# EasyEDA Pro project 消毒盒_灯带——编码器.epro

# Schematic 消毒盒3.0
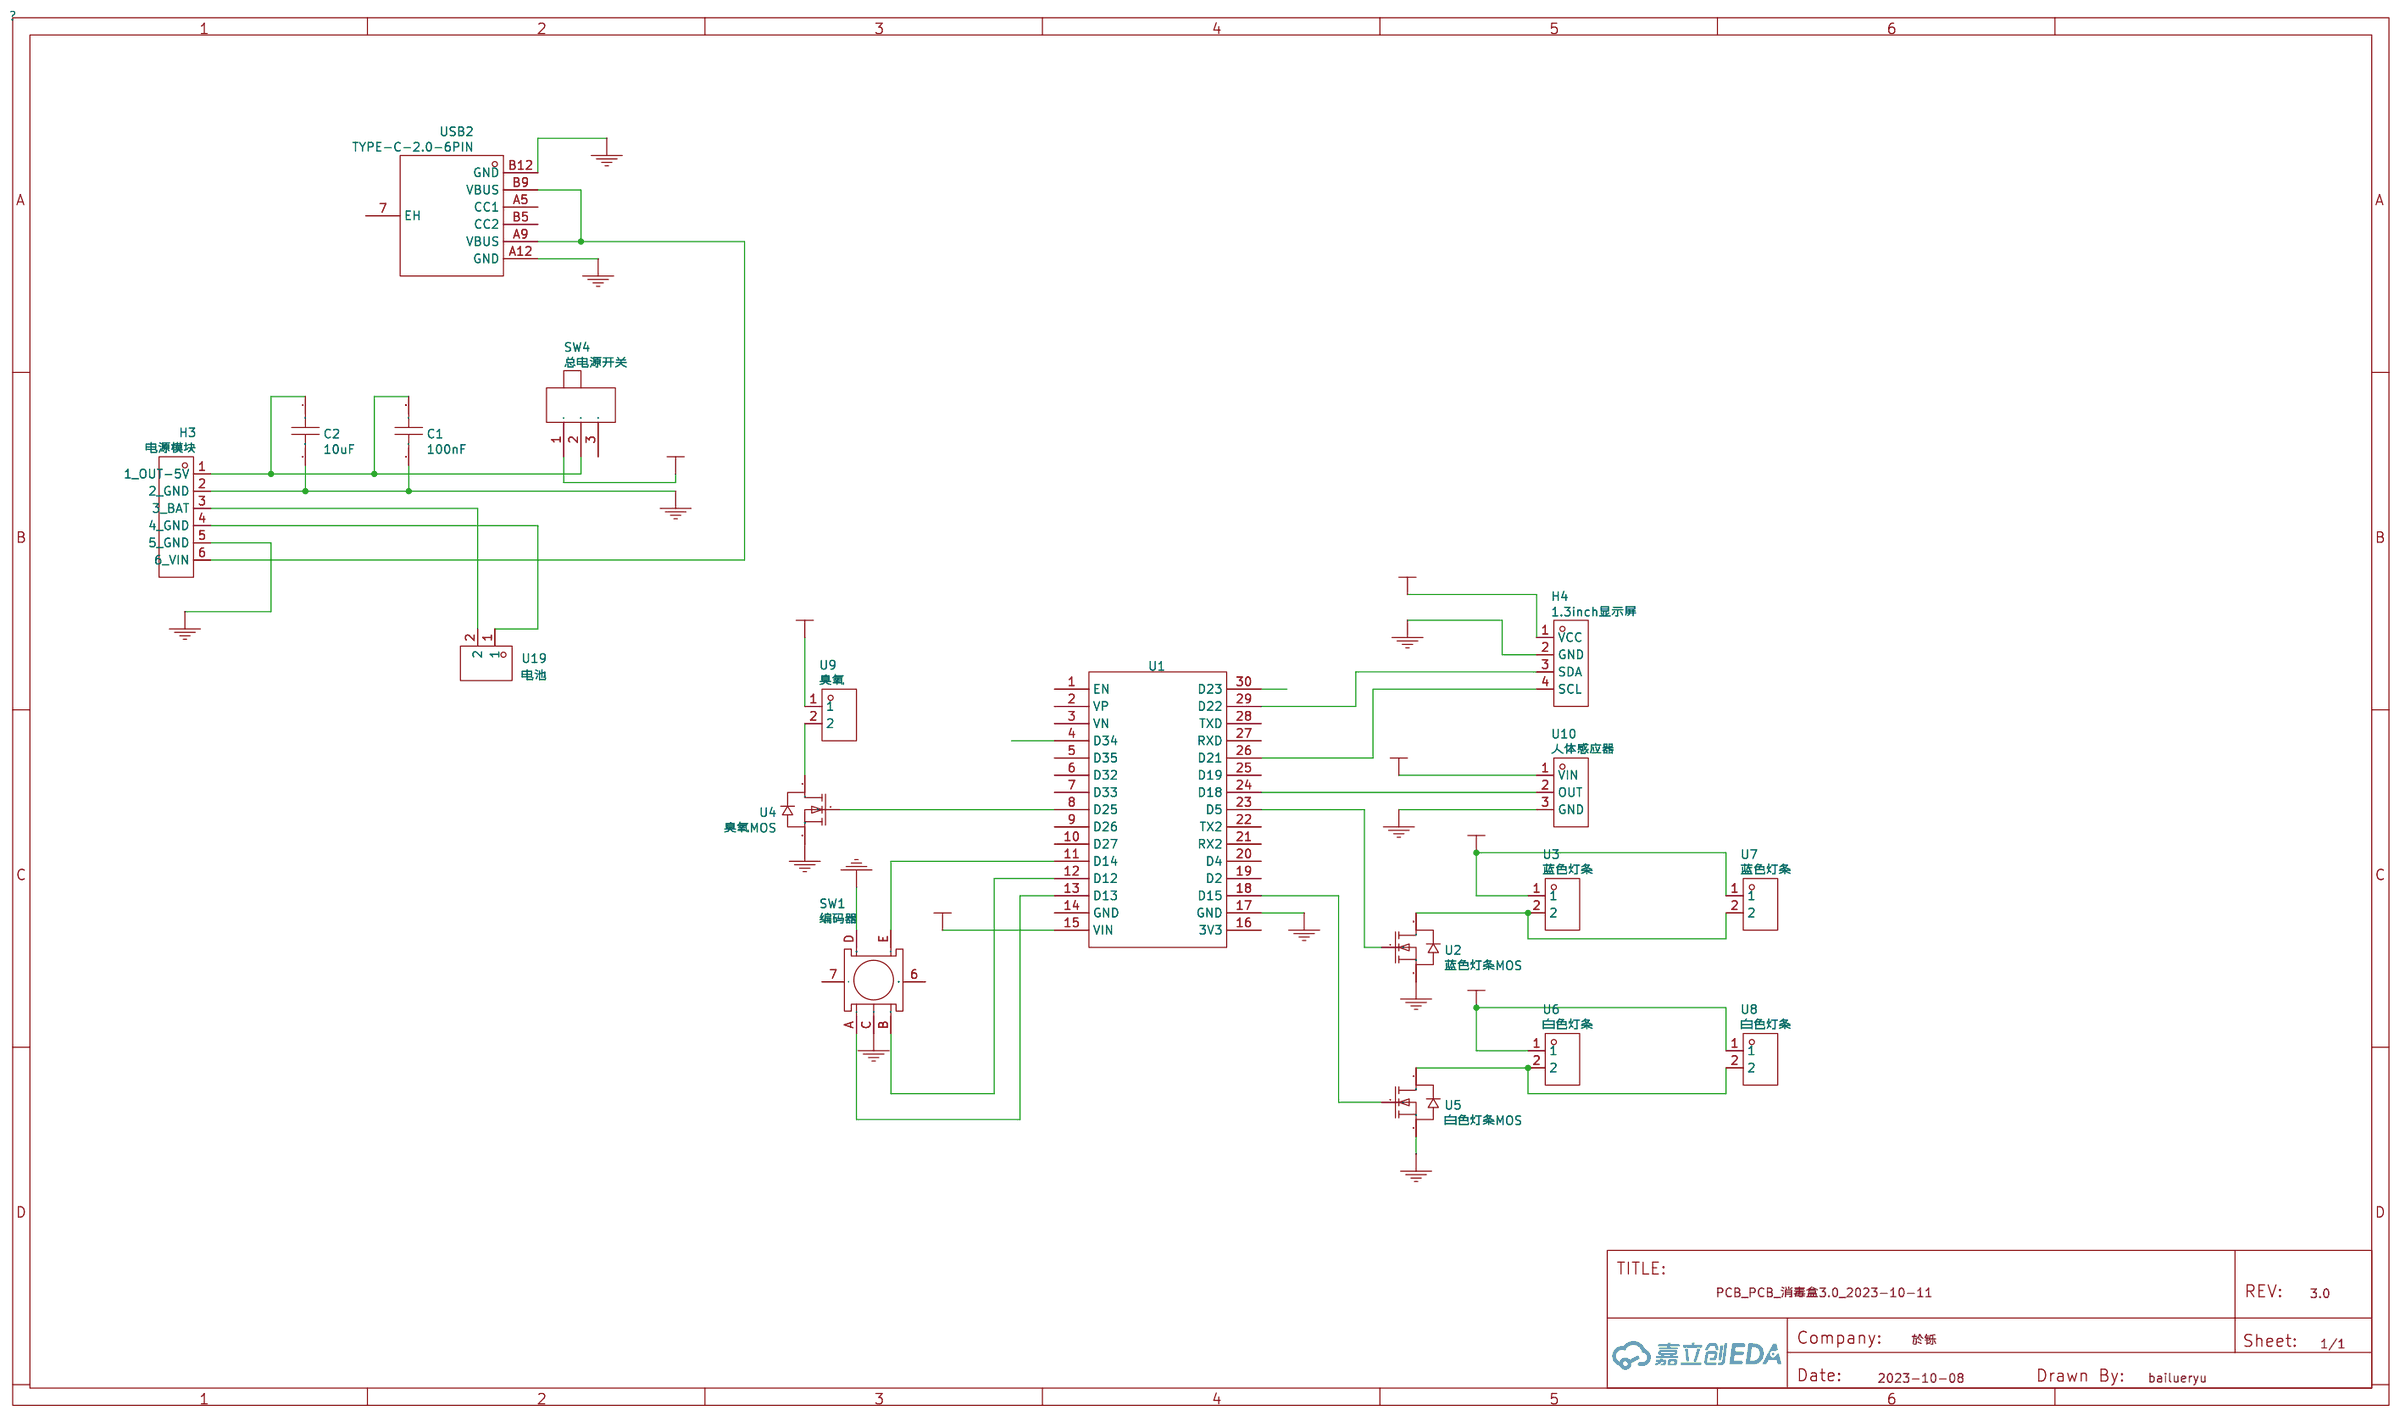
[diagram p0: schematic sheet]

## Parts
C1  100nF  [C0603]
C2  10uF  [C0603]
H3  电源模块  [HDR-TH_6P-P2.54-V-M]
H4  1.3inch显示屏  [HDR-TH_4P-P2.54-V-M]
SW1  编码器  [SW-TH_EC11E18244A5]
SW4  总电源开关  [SW-TH_MK-12D18-G040]
U1  NO  [ESP-WROOM-32]
U2  蓝色灯条MOS  [SOT-23-3_L2.9-W1.3-P1.90-LS2.4-BR]
U3  蓝色灯条  [HDR-TH_2P-P2.00-V-M]
U4  臭氧MOS  [SOT-23-3_L2.9-W1.3-P1.90-LS2.4-BR]
U5  白色灯条MOS  [SOT-23-3_L2.9-W1.3-P1.90-LS2.4-BR]
U6  白色灯条  [HDR-TH_2P-P2.00-V-M]
U7  蓝色灯条  [HDR-TH_2P-P2.00-V-M]
U8  白色灯条  [HDR-TH_2P-P2.00-V-M]
U9  臭氧  [HDR-TH_2P-P2.00-V-M]
U10  人体感应器  [HDR-TH_3P-P2.00-V-M]
U19  电池  [HDR-TH_2P-P2.00-V-M]
USB2  TYPE-C-2.0-6PIN  [TYPE-C-SMD_TYPE-C-6P-2]

## Library data of the parts
C1 = 100nF: link: https://so.szlcsc.com/global.html?k=C3152610&amp;ref=editor; 3DModel: C0603_L1.6-W0.8-H0.8; Supplier: LCSC; Supplier Part: C3152610; Manufacturer: Sunway(信维通信); Manufacturer Part: MC0603B104K500N8RH; JLCPCB Part Class: Extended Part
C2 = 10uF: link: https://so.szlcsc.com/global.html?k=C15415&amp;ref=editor; 3DModel: C0603_L1.6-W0.8-H0.8; Supplier: LCSC; Supplier Part: C15415; Manufacturer: SAMSUNG(三星); JLCPCB Part Class: Extended Part
H3 = 电源模块: link: https://so.szlcsc.com/global.html?k=C492405&amp;ref=editor; 3DModel: HDR-TH_6P-P2.54-M-LI-1X6P; Supplier: LCSC; Supplier Part: C492405; Manufacturer: XFCN(兴飞); Manufacturer Part: PZ254V-11-06P; JLCPCB Part Class: Extended Part
H4 = 1.3inch显示屏: link: https://so.szlcsc.com/global.html?k=C2905435&amp;ref=editor; 3DModel: HDR-TH_4P-P2.54-M-LI-1X4P; Supplier: LCSC; Supplier Part: C2905435; Manufacturer: kinghelm(金航标); Manufacturer Part: KH-2.54PH180-1X4P-L11.5; JLCPCB Part Class: Extended Part
SW1 = 编码器: link: https://so.szlcsc.com/global.html?k=C255515&amp;ref=editor; 3DModel: SW-TH_EC11E18244A5-L11.7-W12.0-H24.5-P2.5-LS14.5; Supplier: LCSC; Supplier Part: C255515; Manufacturer: ALPS Electric; Manufacturer Part: EC11E18244A5; JLCPCB Part Class: Extended Part
SW4 = 总电源开关: link: https://so.szlcsc.com/global.html?k=C3019727&amp;ref=editor; Supplier: LCSC; Supplier Part: C3019727; Manufacturer: G-Switch(品赞); Manufacturer Part: MK-12D18-G020; JLCPCB Part Class: Extended Part
U1 = NO
U2 = 蓝色灯条MOS: link: https://so.szlcsc.com/global.html?k=C5358569&amp;ref=editor; 3DModel: SOT-23-3P_L2.9-W1.3-H1.0-LS2.4-P0.95; Supplier: LCSC; Supplier Part: C5358569; Manufacturer: GOODWORK(固得沃克); Manufacturer Part: 5N10
U3 U7 = 蓝色灯条: link: https://so.szlcsc.com/global.html?k=C18164974&amp;ref=editor; 3DModel: HDR-TH_2P-P2.00-M-LI-1X2P; Supplier: LCSC; Supplier Part: C18164974; Manufacturer: CONNFLY; Manufacturer Part: DS1025-01-1x2P8BV1-B
U4 = 臭氧MOS: link: https://so.szlcsc.com/global.html?k=C5358569&amp;ref=editor; 3DModel: SOT-23-3P_L2.9-W1.3-H1.0-LS2.4-P0.95; Supplier: LCSC; Supplier Part: C5358569; Manufacturer: GOODWORK(固得沃克); Manufacturer Part: 5N10
U5 = 白色灯条MOS: link: https://so.szlcsc.com/global.html?k=C5358569&amp;ref=editor; 3DModel: SOT-23-3P_L2.9-W1.3-H1.0-LS2.4-P0.95; Supplier: LCSC; Supplier Part: C5358569; Manufacturer: GOODWORK(固得沃克); Manufacturer Part: 5N10
U6 U8 = 白色灯条: link: https://so.szlcsc.com/global.html?k=C18164974&amp;ref=editor; 3DModel: HDR-TH_2P-P2.00-M-LI-1X2P; Supplier: LCSC; Supplier Part: C18164974; Manufacturer: CONNFLY; Manufacturer Part: DS1025-01-1x2P8BV1-B
U9 U19 = 臭氧: link: https://so.szlcsc.com/global.html?k=C18164974&amp;ref=editor; 3DModel: HDR-TH_2P-P2.00-M-LI-1X2P; Supplier: LCSC; Supplier Part: C18164974; Manufacturer: CONNFLY; Manufacturer Part: DS1025-01-1x2P8BV1-B
U10 = 人体感应器: link: https://so.szlcsc.com/global.html?k=C18164975&amp;ref=editor; 3DModel: HDR-TH_3P-P2.00-M-LI-1X3P; Supplier: LCSC; Supplier Part: C18164975; Manufacturer: CONNFLY; Manufacturer Part: DS1025-01-1x3P8BV1-B
USB2 = TYPE-C-2.0-6PIN: link: https://so.szlcsc.com/global.html?k=C2987385&amp;ref=editor; Supplier: LCSC; Supplier Part: C2987385; Manufacturer: CIKI(皓富); Manufacturer Part: Type-C-2.0-6Pin; JLCPCB Part Class: Extended Part

## Nets
GND: C1.1 C2.2 H3.2(2 GND) H3.5(5 GND) H4.2(GND) SW1.C SW1.D U1.17(GND) U2.2(S) U4.2(S) U5.2(S) U10.3(GND) USB2.A12(GND) USB2.B12(GND)
VCC: H4.1(VCC) SW4.1 U1.15(VIN) U3.1 U6.1 U7.1 U8.1 U9.1 U10.1(VIN)
$1N74: U1.23(D5) U2.1(G)
$1N112: U1.8(D25) U4.1(G)
$1N132: U1.18(D15) U5.1(G)
$1N227: SW1.A U1.13(D13)
$1N228: SW1.B U1.12(D12)
$1N380: SW1.E U1.11(D14)
Net-(C1-2): C1.2 C2.1 H3.1(1 OUT-5V) SW4.2
Net-(H3-3): H3.3(3 BAT) U19.2
Net-(H3-4): H3.4(4 GND) U19.1
Net-(H3-6): H3.6(6 VIN) USB2.A9(VBUS) USB2.B9(VBUS)
Net-(H4-3): H4.3(SDA) U1.29(D22)
Net-(H4-4): H4.4(SCL) U1.26(D21)
Net-(U1-24): U1.24(D18) U10.2(OUT)
Net-(U2-3): U2.3(D) U3.2 U7.2
Net-(U4-3): U4.3(D) U9.2
Net-(U5-3): U5.3(D) U6.2 U8.2

Not connected (* = marked no-connect by the designer): SW1 6 7; SW4 3; U1 1(EN) 2(VP) 3(VN) 4(D34) 5(D35) 6(D32) 7(D33) 9(D26) 10(D27) 14(GND) 16(3V3) 19(D2) 20(D4) 21(RX2) 22(TX2) 25(D19) 27(RXD) 28(TXD) 30(D23); USB2 7(EH) A5(CC1) B5(CC2)

# Board PCB_PCB_消毒盒3.0_2023-10-11
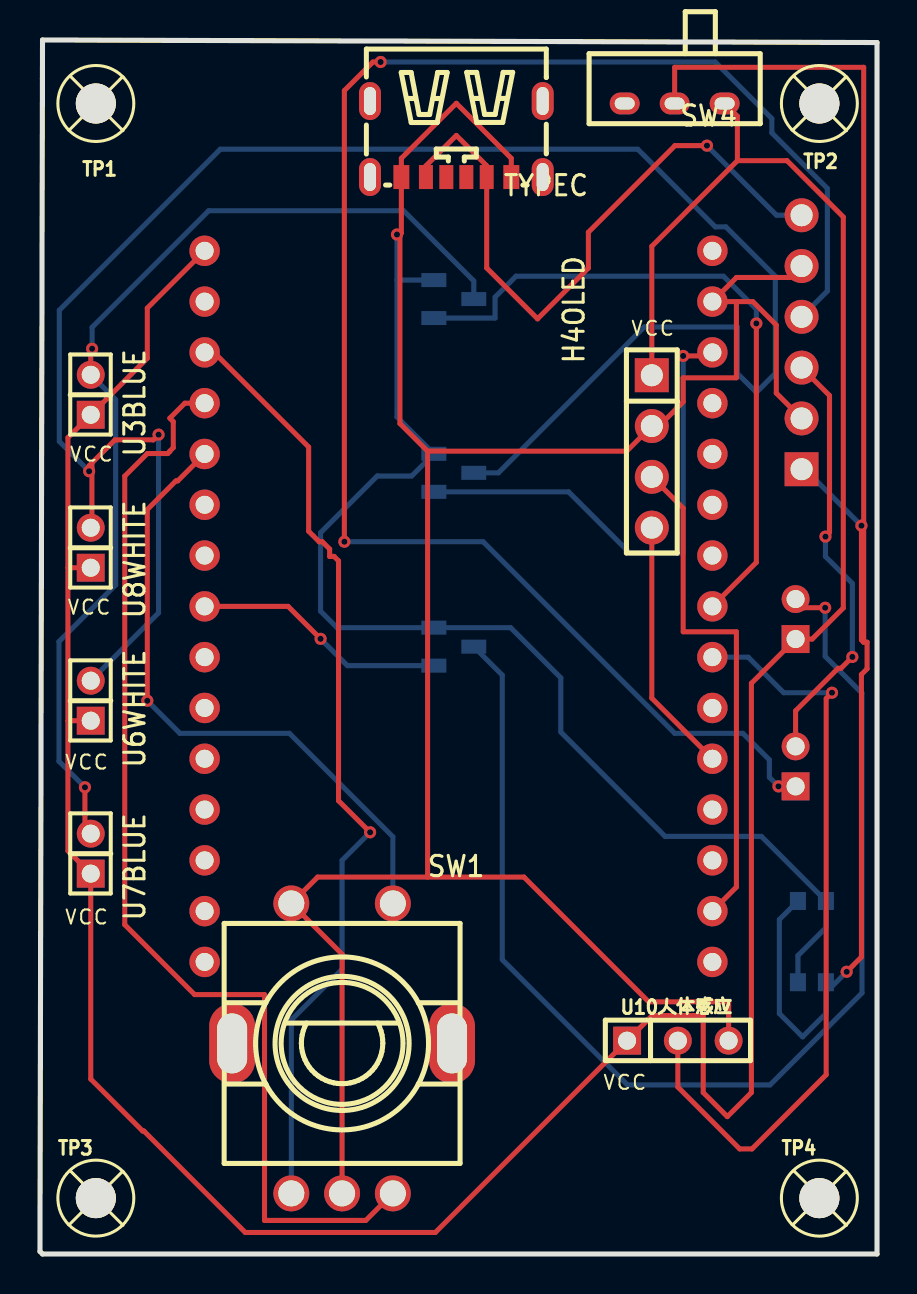
[diagram p1: board, top side]
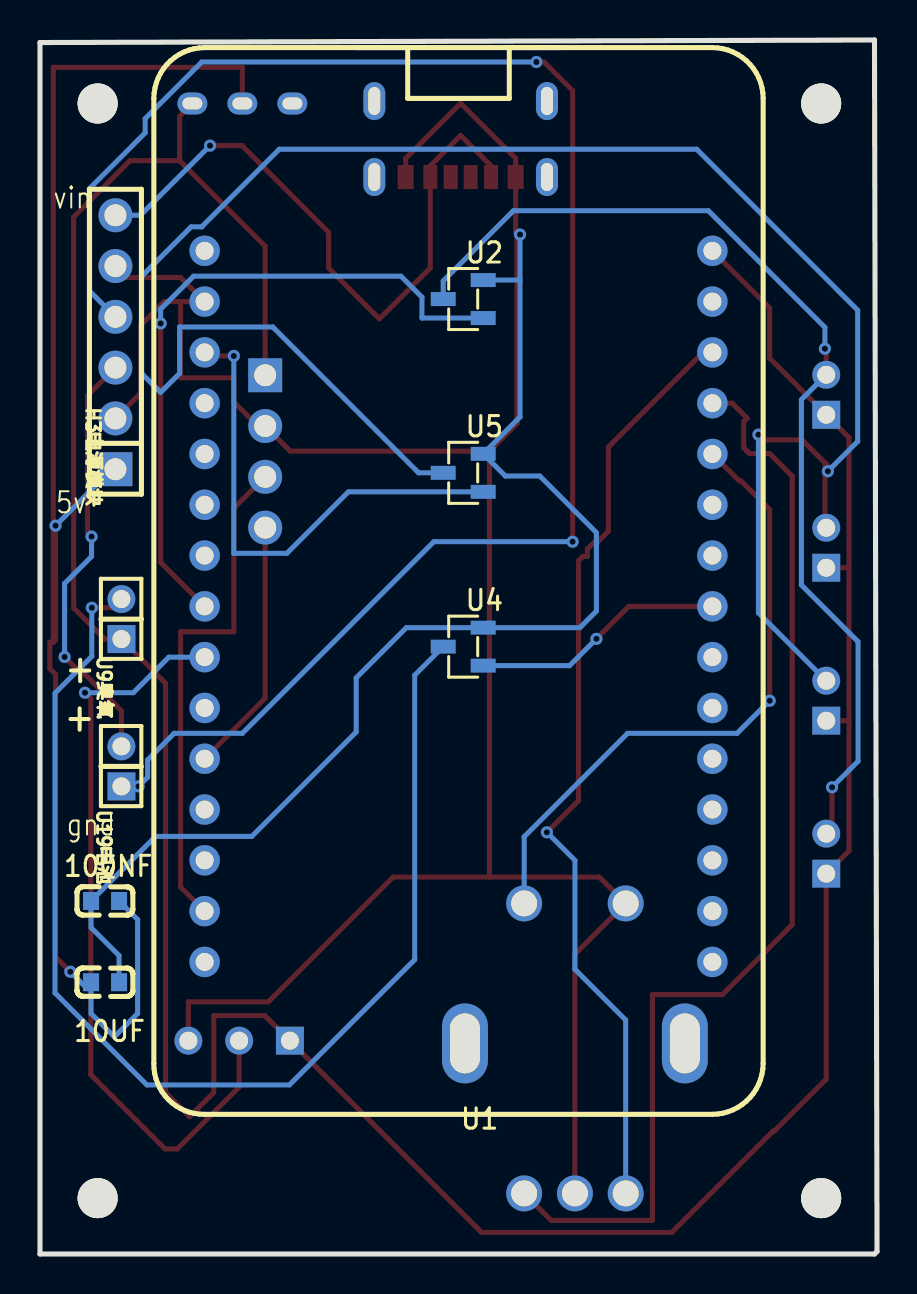
[diagram p2: board, bottom side, seen from below]

Outline 41.87 x 60.71 mm; copper layers: Top Layer, Bottom Layer. Coordinates in mm from the lower left corner of the outline.
Outline path: 0,0.13 0.12,58.77 0.13,60.71 41.87,60.58 41.87,0 0.13,0 0,0.13
Stack: Top Layer 0.035mm / Dielectric1 1.51mm FR4 er 4.5 / Bottom Layer 0.035mm

## Design rules (mm)
template: 用户自定义配置
spacing Default (default): track to track 0.152, other pairs 0 to 0.152
track width Default (default): min 0.254, default 0.254, max 25.4
differential pair differentialPair (default): width min 0.127, default 0.254, max 2.54; gap min 0.152, default 0.152
via Default (default): diameter min 0.61, default 0.61, max 100.025; hole min 0.305, default 0.305, max 59.995

## Placement (name value [footprint] x y rotation side)
10UF  10uF  [C0603]  38.62 13.59 180 bottom
100NF  100nF  [C0603]  38.62 17.65 180 bottom
H3电源模块  电源模块  [HDR-TH_6P-P2.54-V-M]  38.1 45.59 90 bottom
H4OLED  1.3inch显示屏  [HDR-TH_4P-P2.54-V-M]  30.61 40.13 270 top
SW1  编码器  [SW-TH_EC11E18244A5]  15.11 10.28 0 top
SW4  总电源开关  [SW-TH_MK-12D18-G040]  31.75 57.53 180 top
TP1  -  [M2螺丝]  2.79 57.53 0 top
TP2  -  [M2螺丝]  38.99 57.53 0 top
TP3  -  [M2螺丝]  2.79 2.79 0 top
TP4  -  [M2螺丝]  38.99 2.79 0 top
TYPEC  TYPE-C-2.0-6PIN  [TYPE-C-SMD_TYPE-C-6P-2]  20.83 55.75 180 top
U1  NO  [ESP-WROOM-32]  8.24 14.6 0 bottom
U2  蓝色灯条MOS  [SOT-23-3_L2.9-W1.3-P1.90-LS2.4-BR]  20.7 47.75 180 bottom
U3BLUE  蓝色灯条  [HDR-TH_2P-P2.00-V-M]  2.54 42.96 90 top
U4  臭氧MOS  [SOT-23-3_L2.9-W1.3-P1.90-LS2.4-BR]  20.7 30.37 180 bottom
U5  白色灯条MOS  [SOT-23-3_L2.9-W1.3-P1.90-LS2.4-BR]  20.7 39.06 180 bottom
U6WHITE  白色灯条  [HDR-TH_2P-P2.00-V-M]  2.54 27.67 90 top
U7BLUE  蓝色灯条  [HDR-TH_2P-P2.00-V-M]  2.54 20.02 90 top
U8WHITE  白色灯条  [HDR-TH_2P-P2.00-V-M]  2.54 35.32 90 top
U9臭氧  臭氧  [HDR-TH_2P-P2.00-V-M]  37.8 31.75 90 bottom
U10人体感应  人体感应器  [HDR-TH_3P-P2.00-V-M]  31.91 10.67 0 top
U19电池  电池  [HDR-TH_2P-P2.00-V-M]  37.8 24.38 90 bottom

## Footprints (pads in the part's own frame, mm; a bottom-side part is the same pattern mirrored in y, then rotated)
C0603
  rect 0.8x0.9 smd: 1(-0.7,0) 2(0.7,0)
ESP-WROOM-32
  round 1.524 hole 0.9: 1(0,0) 2(0,-2.54) 3(0,-5.08) 4(0,-7.62) 5(0,-10.16) 6(0,-12.7) 7(0,-15.24) 8(0,-17.78) 9(0,-20.32) 10(0,-22.86) 11(0,-25.4) 12(0,-27.94) 13(0,-30.48) 14(0,-33.02) 15(0,-35.56) 16(25.4,-35.56) 17(25.4,-33.02) 18(25.4,-30.48) 19(25.4,-27.94) 20(25.4,-25.4) 21(25.4,-22.86) 22(25.4,-20.32) 23(25.4,-17.78) 24(25.4,-15.24) 25(25.4,-12.7) 26(25.4,-10.16) 27(25.4,-7.62) 28(25.4,-5.08) 29(25.4,-2.54) 30(25.4,0)
HDR-TH_2P-P2.00-V-M
  rect 1.4x1.4 hole 0.9: 1(-1,0)
  round 1.4 hole 0.9: 2(1,0)
HDR-TH_3P-P2.00-V-M
  rect 1.4x1.4 hole 0.9: 1(-2.54,0)
  round 1.4 hole 0.9: 2(0,0) 3(2.54,0)
HDR-TH_4P-P2.54-V-M
  rect 1.7x1.7 hole 1.1: 1(-3.81,0)
  round 1.7 hole 1.1: 2(-1.27,0) 3(1.27,0) 4(3.81,0)
HDR-TH_6P-P2.54-V-M
  rect 1.7x1.7 hole 1.1: 1(-6.35,0)
  round 1.7 hole 1.1: 2(-3.81,0) 3(-1.27,0) 4(1.27,0) 5(3.81,0) 6(6.35,0)
M2螺丝
  round 2 hole 2: 1(0,0)
SOT-23-3_L2.9-W1.3-P1.90-LS2.4-BR
  rect 1.25x0.7 smd: 1(1,-0.95) 2(1,0.95) 3(-1,0)
SW-TH_EC11E18244A5
  oval 2.3x4 hole 1.5x3: 6(5.5,0.25) 7(-5.5,0.25)
  round 1.8 hole 1.3: A(-2.54,-7.25) B(2.54,-7.25) C(0,-7.25) D(-2.54,7.25) E(2.54,7.25)
SW-TH_MK-12D18-G040
  oval 1.5x1.1 hole 1x0.6: 1(-2.5,0) 2(0,0) 3(2.5,0)
TYPE-C-SMD_TYPE-C-6P-2
  oval 1.1x1.9 hole 0.6x1.4: 7(-4.32,1.9) 8(4.32,1.9) 9(-4.32,-1.9) 10(4.32,-1.9)
  rect 0.7x1.2 smd: A5(-0.5,1.9) A9(1.52,1.9) B5(0.5,1.9) B9(-1.52,1.9)
  rect 0.8x1.2 smd: A12(2.75,1.9) B12(-2.75,1.9)

## Nets
GND: 10UF.2 100NF.1 H3电源模块.2 H3电源模块.5 H4OLED.2 SW1.C SW1.D TYPEC.A12 TYPEC.B12 U1.17 U2.2 U4.2 U5.2 U10人体感应.3
VCC: H4OLED.1 SW4.1 U1.15 U3BLUE.1 U6WHITE.1 U7BLUE.1 U8WHITE.1 U9臭氧.1 U10人体感应.1
$1N52: U1.24 U10人体感应.2
$1N53: H4OLED.4 U1.26
$1N54: H4OLED.3 U1.29
$1N74: U1.23 U2.1
$1N90: U2.3 U3BLUE.2 U7BLUE.2
$1N112: U1.8 U4.1
$1N132: U1.18 U5.1
$1N148: U5.3 U6WHITE.2 U8WHITE.2
$1N216: U4.3 U9臭氧.2
$1N227: SW1.A U1.13
$1N228: SW1.B U1.12
$1N229: H3电源模块.6 TYPEC.A9 TYPEC.B9
$1N265: 10UF.1 100NF.2 H3电源模块.1 SW4.2
$1N269: H3电源模块.3 U19电池.2
$1N380: SW1.E U1.11
$1N605: U1.30
$1N701: U1.4
$1N1385: H3电源模块.4 U19电池.1

Pads without a net: SW1 6 7; SW4 3; TP1 1; TP2 1; TP3 1; TP4 1; TYPEC 7 8 9 10 A5 B5; U1 1 2 3 5 6 7 9 10 14 16 19 20 21 22 25 27 28

## Via types
v1: diameter 0.61, hole 0.305, Top Layer to Bottom Layer, 20 vias

## Routing (per net, layer and track width the routed paths; a pad name or vN(x,y) marks a point on that pad's centre or on a via; arc(x,y) is an arc through that point)
GND: length 185.8
  Top Layer w0.254: 19.39,18.85 24.21,18.85 30.45,12.61 34.45,12.61 U10人体感应.3 ; 19.39,18.85 19.39,40.15 ; 19.39,18.85 13.89,18.85 SW1.D 15.11,14.99 15.11,3.03 ; 19.39,40.15 29.35,40.15 H4OLED.2 30.97,41.4 32.18,42.61 32.18,43.81 34.84,43.81 34.84,47.62 ; 19.39,40.15 18.01,41.53 18.01,50.98 ; H3电源模块.5 37.53,48.83 34.84,48.83 U1.17 34.84,47.62 ; 18.01,50.98 18.08,51.05 TYPEC.A12 18.08,54.79 20.83,57.54 23.58,54.79 TYPEC.B12 ; 18.01,50.98 v1(17.86,50.98) ; 34.84,47.62 35.66,47.62 36.83,46.45 36.83,43.05 H3电源模块.2
  Bottom Layer w0.254: U2.2 17.86,48.7 ; 17.86,48.7 17.86,41.85 U5.2 18.59,38.9 16.87,38.9 14.04,36.07 14.04,32.15 14.86,31.32 U4.2 23.54,31.32 26.05,28.81 26.05,26.1 31.27,20.88 36.09,20.88 100NF.1 39.32,16.32 37.92,14.92 10UF.2 ; 17.86,48.7 v1(17.86,50.98)
VCC: length 160.8
  Top Layer w0.254: 1.4,34.32 1.4,40.82 U3BLUE.1 5.37,44.79 5.37,47.3 U1.15 ; 1.4,34.32 U8WHITE.1 ; 1.4,34.32 1.4,26.67 ; 34.89,54.67 30.61,50.39 H4OLED.1 ; 34.89,54.67 37.37,54.67 40.19,51.85 40.19,32.31 38.63,30.75 U9臭氧.1 35.59,28.54 35.59,8.07 34.38,6.87 33.18,8.07 33.18,11.92 30.63,11.92 U10人体感应.1 19.78,1.08 10.27,1.08 5.2,6.15 5.14,6.15 2.54,8.75 U7BLUE.1 1.4,20.16 1.4,26.67 ; 34.89,54.67 34.89,56.89 SW4.1 ; U6WHITE.1 1.4,26.67
$1N52: length 38.5
  Top Layer w0.254: U10人体感应.2 31.91,8.35 35,5.25 35.62,5.25 39.33,8.97 39.33,27.78 v1(39.62,28.07)
  Bottom Layer w0.254: 33.64,29.84 35.43,29.84 37.21,28.07 v1(39.62,28.07)
$1N53: length 12.8
  Top Layer w0.254: 33.64,24.77 30.61,27.79 H4OLED.4
$1N54: length 25.5
  Top Layer w0.254: U1.29 34.84,18.35 34.84,31.11 32.18,31.11 32.18,37.29 H4OLED.3
$1N74: length 34.1
  Top Layer w0.254: v1(35.84,46.53) 35.84,34.58 U1.23
  Bottom Layer w0.254: v1(35.84,46.53) 35.84,47.25 34.19,48.89 23.81,48.89 22.77,47.85 22.77,46.8 U2.1
$1N90: length 51.6
  Top Layer w0.254: U7BLUE.2 2.25,21.31 v1(2.25,23.34) ; U3BLUE.2 2.54,45.2 v1(2.61,45.27)
  Bottom Layer w0.254: v1(2.61,45.27) 2.61,46.34 8.44,52.17 18.19,52.17 21.7,48.66 U2.3 ; v1(2.25,23.34) 0.95,24.64 0.95,30.62 3.78,33.46 3.78,42.72 U3BLUE.2
$1N112: length 12.7
  Top Layer w0.254: v1(14.04,30.76) 12.41,32.38 U1.8
  Bottom Layer w0.254: v1(14.04,30.76) 15.38,29.42 U4.1
$1N132: length 25.2
  Top Layer w0.254: U1.18 33.46,44.91 v1(32.18,44.91)
  Bottom Layer w0.254: v1(32.18,44.91) 32.18,35.04 29.52,35.04 26.44,38.11 U5.1
$1N148: length 97.9
  Top Layer w0.254: 2.6,39.56 2.46,39.42 v1(2.46,39.14) ; 2.6,39.56 2.6,36.38 U8WHITE.2 ; 2.6,39.56 3.75,40.71 5.67,40.71 v1(5.93,40.97)
  Bottom Layer w0.254: v1(5.93,40.97) 5.93,32.06 U6WHITE.2 ; v1(2.46,39.14) 0.97,40.63 0.97,47.19 9.02,55.24 29.9,55.24 33.78,51.36 34.31,51.36 36.78,48.89 36.78,44.03 35.84,43.08 34.89,44.03 34.89,46.35 30.23,46.35 22.93,39.06 U5.3
$1N216: length 60.4
  Top Layer w0.254: v1(39.28,32.32) 38.23,32.32 U9臭氧.2
  Bottom Layer w0.254: U4.3 23.13,28.95 23.13,14.72 29.39,8.45 36.52,8.45 41.12,13.05 41.12,28.04 39.28,29.88 v1(39.28,32.32)
$1N227: length 47.6
  Top Layer w0.254: v1(16.51,21.09) 14.93,22.67 14.93,34.66 14.71,34.88 14.49,34.88 14.49,35.25 14.12,35.62 13.97,35.62 13.44,36.14 13.44,40.35 8.71,45.08 U1.13
  Bottom Layer w0.254: v1(16.51,21.09) 15.11,19.69 15.11,14.24 12.57,11.7 12.57,3.03
$1N228: length 55.8
  Top Layer w0.254: U1.12 7.25,42.54 6.5,41.79 6.67,41.62 6.67,40.32 6.5,40.15 6.5,40.13 6.39,40.03 5.37,40.03 4.24,38.9 4.24,16.47 7.74,12.97 11.23,12.97 11.23,1.68 16.3,1.68 17.65,3.03
$1N229: length 32.8
  Top Layer w0.254: TYPEC.A9 19.31,54.41 20.83,55.93 22.35,54.41 TYPEC.B9 22.35,49.31 24.89,46.76 27.43,49.31 27.43,51.09 31.76,55.42 v1(33.37,55.42)
  Bottom Layer w0.254: v1(33.37,55.42) 36.85,51.94 H3电源模块.6
$1N265: length 79.4
  Top Layer w0.254: 41.21,30.59 41.09,30.71 v1(41.09,36.42) ; 41.21,30.59 41.21,59.34 31.75,59.34 SW4.2 ; 41.21,30.59 41.38,30.59 41.38,29.26 41.09,28.98 41.09,14.85 v1(40.36,14.11)
  Bottom Layer w0.254: 10UF.1 39.32,13.27 ; 39.32,13.27 39.32,12.02 38.15,10.86 36.99,12.02 36.99,16.72 100NF.2 ; 39.32,13.27 39.52,13.27 v1(40.36,14.11) ; v1(41.09,36.42) 38.27,39.24 H3电源模块.1
$1N269: length 21.4
  Top Layer w0.254: v1(39.29,35.87) 39.5,36.08 39.5,42.93 H3电源模块.3 ; v1(40.64,29.86) 40.07,29.29 39.93,29.29 37.8,27.16 U19电池.2
  Bottom Layer w0.254: v1(40.64,29.86) 40.64,33.53 39.29,34.88 v1(39.29,35.87)
$1N380: length 32
  Top Layer w0.254: U1.11 6.89,38.66 6.8,38.66 5.37,37.23 v1(5.37,27.67)
  Bottom Layer w0.254: v1(5.37,27.67) 7,26.03 12.48,26.03 17.65,20.86 SW1.E
$1N1385: length 85.5
  Top Layer w0.254: v1(15.23,35.62) 15.23,58.18 16.66,59.61 v1(17.04,59.61) ; v1(36.94,23.38) U19电池.1
  Bottom Layer w0.254: v1(36.94,23.38) 36.49,23.84 36.49,24.71 35.16,26.03 31.75,26.03 22.17,35.62 v1(15.23,35.62) ; H3电源模块.4 39.39,48.15 39.39,53.28 36.61,56.06 36.61,56.78 33.78,59.61 v1(17.04,59.61)

## Text on the board
Bottom Silkscreen Layer: gnd | 5v | vin | +
Top Silkscreen Layer: vcc
